# Altium schematic sheet 1_Sheet_1.schdoc
size 497 x 243 mm; Name: A_A4; Symbol: A_A4; Device: A_A4; @Project Name: 【彩色丝印】 MLX90640热成像模块; REV: 1.0; Date: 2022-10-16; Sheet: 1/1; Draw By: Aurora_Borealis; Company: Your Company; Convert to PCB: yes; Add into BOM: yes
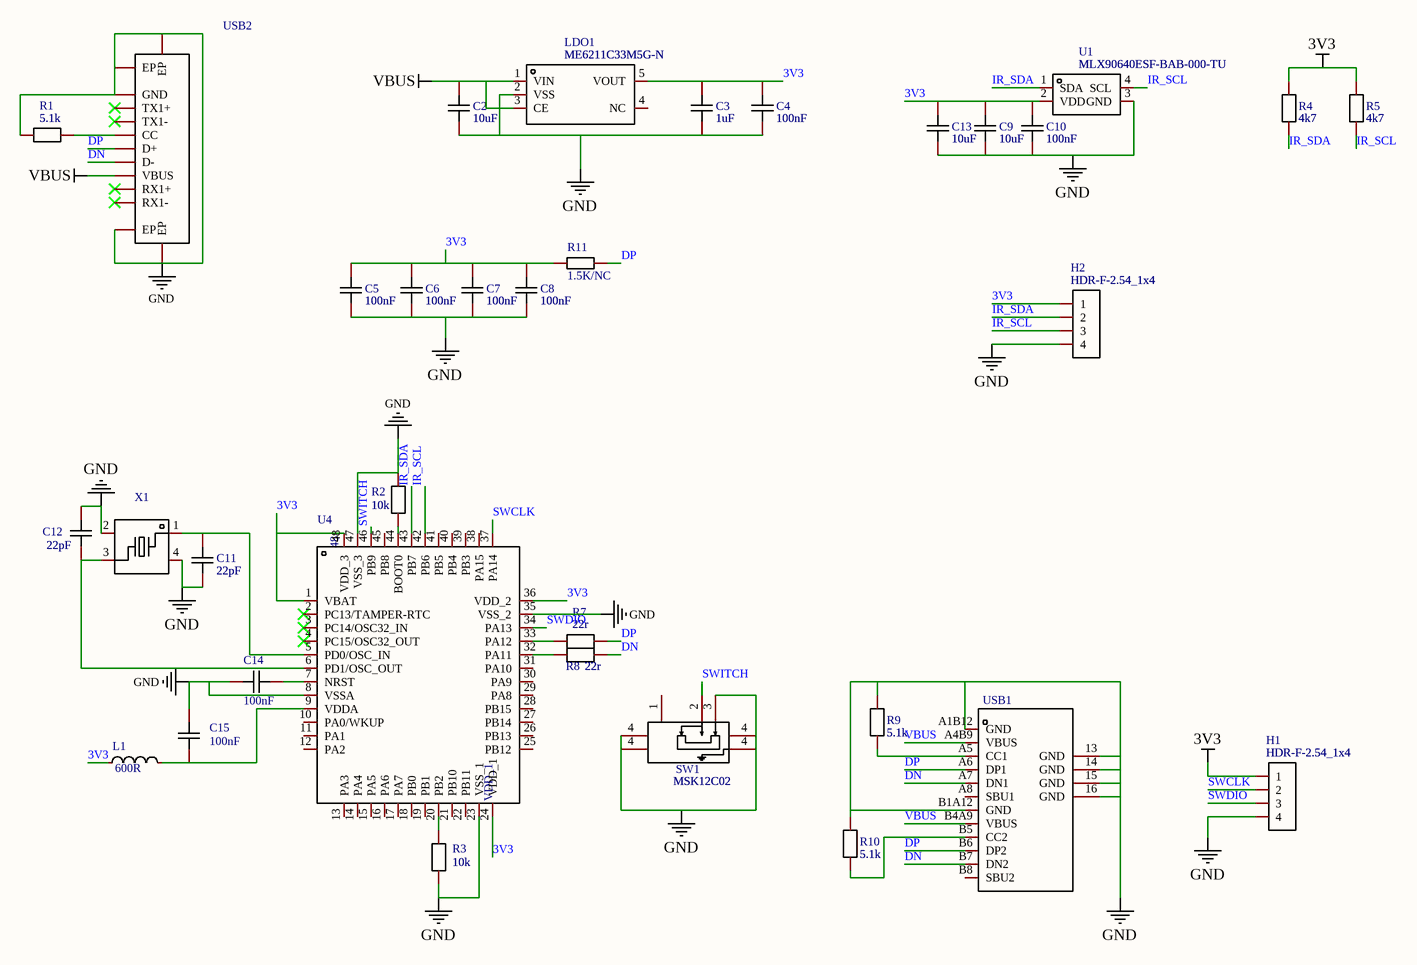
[diagram p0: 1_Sheet_1.schdoc]

## Parts
C2  10uF  [C0603]
C3  1uF  [C0603]
C4  100nF  [C0603]
C5  100nF  [C0603]
C6  100nF  [C0603]
C7  100nF  [C0603]
C8  100nF  [C0603]
C9  10uF  [C0603]
C10  100nF  [C0603]
C11  22pF  [C0603]
C12  22pF  [C0603]
C13  10uF  [C0603]
C14  value 100nF  [C0603]  (hidden comment: CAP_0603)
C15  value 100nF  [C0603]  (hidden comment: CAP_0603)
H1  HDR-F-2.54_1x4  [HDR-F-2.54_1X4]
H2  HDR-F-2.54_1x4  [HDR-F-2.54_1X4]
L1  value 600R  [L0603]  (hidden comment: L_0603)
LDO1  ME6211C33M5G-N  [SOT-23-5_L3.0-W1.7-P0.95-LS2.8-BR]
R1  5.1k  [R0603]
R2  10k  [R0603]
R3  10k  [R0603]
R4  4k7  [R0603]
R5  4k7  [R0603]
R7  22r  [R0603]
R8  22r  [R0603]
R9  5.1k  [R0603]
R10  5.1k  [R0603]
R11  value 1.5K/NC  [R0603]  (hidden comment: Res_0603)
SW1  MSK12C02  [SW-TH_MSK12C02]
U1  MLX90640ESF-BAB-000-TU  [TO-39-4_MELEXIS_MLX90640]
U4  NAME: VDD_1  NUMBER: 48  [LQFP-48_L7.0-W7.0-P0.50-LS9.0-BL]  (hidden comment: AT32F403ACGT7)
USB1  TYPEC-304-BCP16  [USB-C-SMD_TYPEC-304-BCP16]  (value not drawn)
USB2  TYPEC公头9P贴片沉板  [TYPEC公头9P夹板]  (value not drawn)
X1  CJ13-120001210B20  [CRYSTAL-SMD_4P-L3.2-W2.5-BL]  (value not drawn)

## Nets
3V3: C3.2 C4.2 C5.2 C6.2 C7.2 C8.2 C9.2 C10.2 C13.2 H1.1 H2.1 L1.1 LDO1.5(VOUT) R4.2 R5.2 R11.1 U1.2(VDD) U4.1(VBAT) U4.24(VDD_1) U4.36(VDD_2) U4.48(VDD_3)
GND: C2.1 C3.1 C4.1 C5.1 C6.1 C7.1 C8.1 C9.1 C10.1 C11.1 C12.2 C13.1 C14.1 C15.1 H1.4 H2.4 LDO1.2(VSS) R1.1 R2.2 R3.1 R9.1 R10.1 SW1.3 SW1.4 U1.3(GND) U4.8(VSSA) U4.23(VSS_1) U4.35(VSS_2) U4.47(VSS_3) USB1.13(GND) USB1.14(GND) USB1.15(GND) USB1.16(GND) USB1.A1B12(GND) USB1.B1A12(GND) USB2.A1(GND) USB2.GND1(EP) USB2.GND2(EP) USB2.GND3(EP) USB2.GND4(EP) X1.2(GND) X1.4(GND)
VBUS: C2.2 LDO1.1(VIN) LDO1.3(CE) USB1.A4B9(VBUS) USB1.B4A9(VBUS) USB2.A9(VBUS)
DN: R8.2 USB1.A7(DN1) USB1.B7(DN2) USB2.A7(D-)
DP: R7.2 R11.2 USB1.A6(DP1) USB1.B6(DP2) USB2.A6(D+)
IR_SCL: H2.3 R5.1 U1.4(SCL) U4.42(PB6)
IR_SDA: H2.2 R4.1 U1.1(SDA) U4.43(PB7)
SWCLK: H1.2 U4.37(PA14)
SWDIO: H1.3 U4.34(PA13)
SWITCH: SW1.2 U4.46(PB9)
NetC11_2: C11.2 U4.5(PD0/OSC_IN) X1.1
NetC12_1: C12.1 U4.6(PD1/OSC_OUT) X1.3
NetC14_2: C14.2 U4.7(NRST)
NetC15_2: C15.2 L1.2 U4.9(VDDA)
NetR1_2: R1.2 USB2.A5(CC)
NetR2_1: R2.1 U4.44(BOOT0)
NetR3_2: R3.2 U4.20(PB2)
NetR7_1: R7.1 U4.33(PA12)
NetR8_1: R8.1 U4.32(PA11)
NetR9_2: R9.2 USB1.A5(CC1)
NetR10_2: R10.2 USB1.B5(CC2)

Not connected (* = marked no-connect by the designer): LDO1 4(NC); SW1 1; U4 2(PC13/TAMPER-RTC)* 3(PC14/OSC32_IN)* 4(PC15/OSC32_OUT)* 10(PA0/WKUP) 11(PA1) 12(PA2) 13(PA3) 14(PA4) 15(PA5) 16(PA6) 17(PA7) 18(PB0) 19(PB1) 21(PB10) 22(PB11) 25(PB12) 26(PB13) 27(PB14) 28(PB15) 29(PA8) 30(PA9) 31(PA10) 38(PA15) 39(PB3) 40(PB4) 41(PB5) 45(PB8); USB1 A8(SBU1) B8(SBU2); USB2 A2(TX1+)* A3(TX1-)* B10(RX1-)* B11(RX1+)*

## Notes on the sheet
- 1
- 2
- 3
- 4
- 5
- A
- B
- C
- D
- TITLE:
- 【彩色丝印】 MLX90640热成像模块
- REV:
- 1.0
- Date:
- Company:
- 2022-10-16
- Your Company
- Drawn By:
- Aurora_Borealis
- Sheet:
- 1/1

## Library data of the parts
C2 C3 = 1uF: Convert to PCB: yes; Symbol: 1uF; Device: 1uF; Add into BOM: yes; Origin Footprint: C0603
  C2: Name: 10uF
  C3: Name: 1uF
C4-C8 C10 = 100nF: Convert to PCB: yes; Name: 100nF; Symbol: 100nF; Device: 100nF; Add into BOM: yes; Origin Footprint: C0603
C9 C13 = 10uF: Convert to PCB: yes; Name: 10uF; Symbol: 10uF; Device: 10uF; Add into BOM: yes; Origin Footprint: C0603
C11 C12 = 22pF: Convert to PCB: yes; Name: 22pF; Symbol: 22pF; Device: 22pF; Add into BOM: yes; Origin Footprint: C0603
C14 C15 = CAP_0603: Symbol: C1210X7R475K630NT; Convert to PCB: yes; Name: 100nF; Device: CAP_0603; Add into BOM: yes; Supplier Footprint: 0603
H1 = HDR-F-2.54_1x4: Convert to PCB: yes; Name: HDR-F-2.54_1x4; Symbol: HDR-F-2.54_1x4; Device: HDR-F-2.54_1x4; Supplier Part: C225501; Supplier: LCSC; Add into BOM: yes; Origin Footprint: HDR-F-2.54_1X4
H2 = HDR-F-2.54_1x4: Convert to PCB: yes; NUMBER: 4; Name: HDR-F-2.54_1x4; Symbol: HDR-F-2.54_1x4; Device: HDR-F-2.54_1x4; Supplier Part: C225501; Supplier: LCSC; Add into BOM: yes; Origin Footprint: HDR-F-2.54_1X4
L1 = L_0603: Symbol: SDFL1608S100KTF; Add into BOM: yes; Name: 600R; Device: L_0603; Supplier Footprint: L0603; Convert to PCB: yes
LDO1 = ME6211C33M5G-N: Manufacturer: MICRONE; Convert to PCB: yes; Name: ME6211C33M5G-N; Symbol: ME6211C33M5G-N; Device: ME6211C33M5G-N; Supplier: LCSC; Manufacturer Part: ME6211C33M5G-N; Supplier Part: C82942; JLCPCB Part Class: Extended Part; Add into BOM: yes; Origin Footprint: SOT-23-5_L3.0-W1.7-P0.95-LS2.8-BR
R1 R9 R10 = 5.1k: Convert to PCB: yes; Name: 5.1k; Symbol: 5.1k; Device: 5.1k; Add into BOM: yes; Origin Footprint: R0603
R2 R3 = 1k: Convert to PCB: yes; Name: 10k; Symbol: 1k; Device: 1k; Add into BOM: yes; Origin Footprint: R0603
R4 R5 = 4k7: Convert to PCB: yes; Name: 4k7; Symbol: 4k7; Device: 4k7; Add into BOM: yes; Origin Footprint: R0603
R7 R8 = 22r: Convert to PCB: yes; Name: 22r; Symbol: 22r; Device: 22r; Add into BOM: yes; Origin Footprint: R0603
R11 = Res_0603: Symbol: 电阻; Convert to PCB: yes; Name: 1.5K/NC; Device: Res_0603; Add into BOM: yes; Supplier Footprint: 0603
SW1 = MSK12C02: Manufacturer: SHOU HAN; Convert to PCB: yes; Name: MSK12C02; Symbol: MSK12C02; Device: MSK12C02; Supplier: LCSC; Supplier Part: C431540; Manufacturer Part: MSK12C02; JLCPCB Part Class: Extended Part; Add into BOM: yes; Origin Footprint: SW-TH_MSK12C02
U1 = MLX90640ESF-BAB-000-TU: Manufacturer: Melexis(比利时迈来芯); Convert to PCB: yes; Name: MLX90640ESF-BAB-000-TU; Symbol: MLX90640ESF-BAB-000-TU; Device: MLX90640ESF-BAB-000-TU; Supplier: LCSC; Supplier Part: C488251; Manufacturer Part: MLX90640ESF-BAB-000-TU; link: https://atta.szlcsc.com/upload/public/pdf/source/20200318/C488251_85813F440C116665020FF93BD24900EE.pdf; Add into BOM: yes; Origin Footprint: TO-39-4_MELEXIS_MLX90640
U4 = AT32F403ACGT7: 频率 (MHz)：240，FLASH (KB)：1024，SRAM (KB)：224，CPU：ARM? Cortex?-M4，工作电压（V）：2.6~3.6，工作温度：-40°C ~ 105°C，封装：LQFP48; Manufacturer: ARTERY（雅特力）; Add into BOM: yes; Name: AT32F403ACGT7; Symbol: AT32F403ACGT7; Device: AT32F403ACGT7; LCSC Part Name: AT32F403ACGT7; Supplier Part: C528437; Manufacturer Part: AT32F403ACGT7; Supplier Footprint: LQFP-48; JLCPCB Part Class: Extended Part; Datasheet: https://atta.szlcsc.com/upload/public/pdf/source/20200507/C528435_60E4F7A933572380D38CD1507797F883.pdf; Supplier: LCSC; Convert to PCB: yes
USB1 = TYPEC-304-BCP16: Manufacturer: XUNPU; Convert to PCB: yes; Name: TYPEC-304-BCP16; Symbol: TYPEC-304-BCP16; Device: TYPEC-304-BCP16; Supplier: LCSC; Supplier Part: C720629; Manufacturer Part: TYPEC-304-BCP16; JLCPCB Part Class: Extended Part; Add into BOM: yes; Origin Footprint: USB-C-SMD_TYPEC-304-BCP16
USB2 = TYPEC公头9P贴片沉板: Add into BOM: yes; Name: TYPEC公头9P贴片沉板; Symbol: TYPEC公头9P贴片沉板; Device: TYPEC公头9P贴片沉板; Convert to PCB: yes; Supplier: NEXINS
X1 = CJ13-120001210B20: Manufacturer: CJ（江苏长电/长晶）; Convert to PCB: yes; Name: CJ13-120001210B20; Symbol: CJ13-120001210B20; Device: CJ13-120001210B20; Supplier: LCSC; Supplier Part: C2875246; Manufacturer Part: CJ13-120001210B20; JLCPCB Part Class: Extended Part; Add into BOM: yes; Origin Footprint: CRYSTAL-SMD_4P-L3.2-W2.5-BL